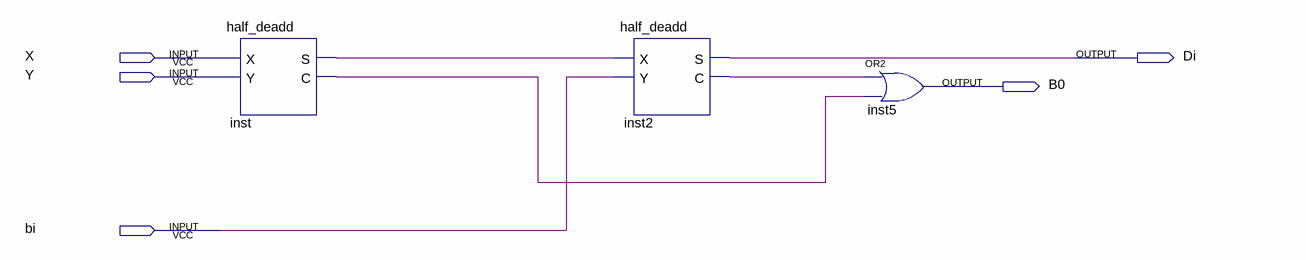
[diagram p0: schematic sheet]
// Quartus schematic deadder.bdf as structural Verilog: 3 symbols, 5 pins
module deadder (
  input  X,
  input  Y,
  input  bi,
  output Di,
  output B0
);

  wire inst2_c, inst_c, inst_s;

  half_deadd inst (.X(X), .Y(Y), .S(inst_s), .C(inst_c));
  half_deadd inst2 (.X(inst_s), .Y(bi), .S(Di), .C(inst2_c));
  or inst5 (B0, inst2_c, inst_c);
endmodule
